# Altium schematic sheet PCB_DA2.schdoc
size 287 x 176 mm
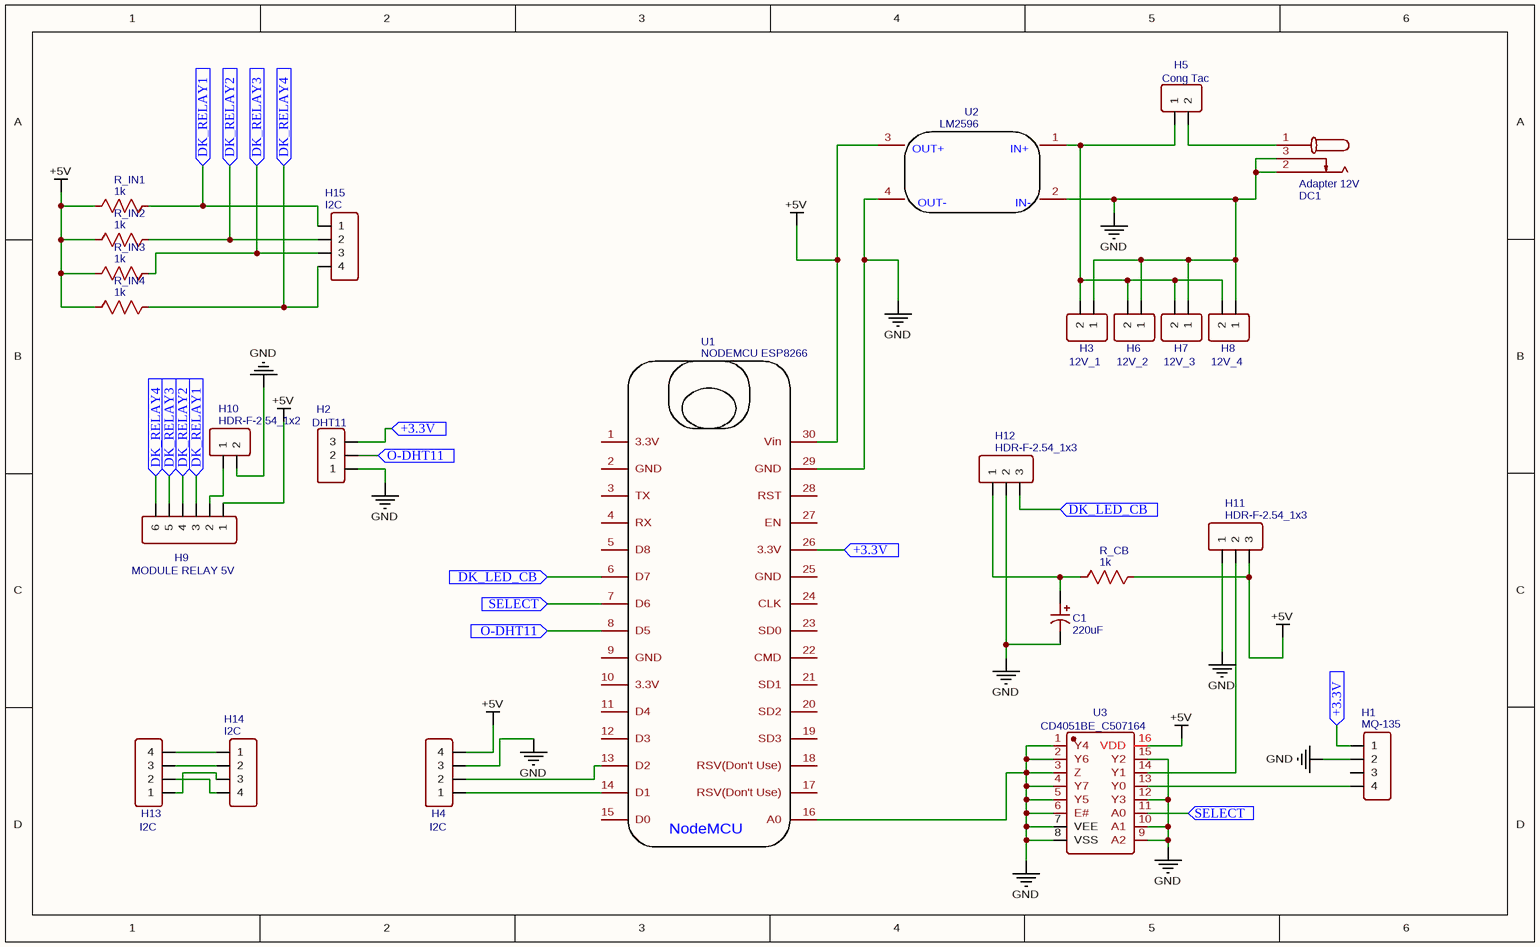
[diagram p0: PCB_DA2.schdoc]

## Parts
C1  220uF  [CAP-TH_BD10.0-P5.00-D0.6-FD]
DC1  Adapter 12V  [DC-IN-TH_DC005]
H1  MQ-135  [HDR-F-2.54_1X4]
H2  DHT11  [HDR-F-2.54_1X3]
H3  12V_1  [HDR-F-2.54_1X2]
H4  I2C  [HDR-F-2.54_1X4]
H5  Cong Tac  [HDR-F-2.54_1X2]
H6  12V_2  [HDR-F-2.54_1X2]
H7  12V_3  [HDR-F-2.54_1X2]
H8  12V_4  [HDR-F-2.54_1X2]
H9  MODULE RELAY 5V  [HDR-F-2.54_1X6]
H10  HDR-F-2.54_1x2  [HDR-F-2.54_1X2]
H11  HDR-F-2.54_1x3  [HDR-F-2.54_1X3]
H12  HDR-F-2.54_1x3  [HDR-F-2.54_1X3]
H13  I2C  [HDR-F-2.54_1X4]
H14  I2C  [HDR-F-2.54_1X4]
H15  I2C  [HDR-F-2.54_1X4]
R_CB  1k  [R_AXIAL-0.5]
R_IN1  1k  [R_AXIAL-0.5]
R_IN2  1k  [R_AXIAL-0.5]
R_IN3  1k  [R_AXIAL-0.5]
R_IN4  1k  [R_AXIAL-0.5]
U1  NODEMCU ESP8266  [ESP12E_DEVKIT-V1]
U2  LM2596  [LM2596DC_DC]
U3  CD4051BE_C507164  [DIP-16_L20.0-W6.4-P2.54-LS7.6-BL]

## Ports
+3.3V (in), DK_LED_CB (in), DK_RELAY1 (in), DK_RELAY2 (in), DK_RELAY3 (in), DK_RELAY4 (in), O-DHT11 (in), SELECT (in)

## Nets
+5V: H4.4 H9.1 H11.3 R_CB.2 R_IN1.1 R_IN2.1 R_IN3.1 R_IN4.1 U1.30(Vin) U2.3 U3.16(VDD)
GND: C1.2 DC1.2 DC1.3 H1.2 H2.1 H3.1 H4.3 H6.1 H7.1 H8.1 H10.2 H11.1 H12.2 U1.16(A0) U1.29(GND) U2.2 U2.4 U3.1(Y4) U3.2(Y6) U3.3(Z) U3.4(Y7) U3.5(Y5) U3.6(E#) U3.7(VEE) U3.8(VSS) U3.9(A2) U3.10(A1) U3.12(Y3) U3.15(Y2)
+3.3V: H1.1 H2.3 U1.26(3.3V) ; port +3.3V
DK_LED_CB: H12.3 U1.6(D7) ; port DK_LED_CB
DK_RELAY1: H9.3 H15.1 R_IN1.2 ; port DK_RELAY1
DK_RELAY2: H9.4 H15.2 R_IN2.2 ; port DK_RELAY2
DK_RELAY3: H9.5 H15.3 R_IN3.2 ; port DK_RELAY3
DK_RELAY4: H9.6 H15.4 R_IN4.2 ; port DK_RELAY4
O-DHT11: H2.2 U1.8(D5) ; port O-DHT11
SELECT: U1.7(D6) U3.11(A0) ; port SELECT
NetC1_1: C1.1 H12.1 R_CB.1
NetDC1_1: DC1.1 H5.2
NetH1_4: H1.4 U3.13(Y0)
NetH3_2: H3.2 H5.1 H6.2 H7.2 H8.2 U2.1
NetH4_1: H4.1 U1.14(D1)
NetH4_2: H4.2 U1.13(D2)
NetH9_2: H9.2 H10.1
NetH11_2: H11.2 U3.14(Y1)
NetH13_1: H13.1 H14.3
NetH13_2: H13.2 H14.4
NetH13_3: H13.3 H14.2
NetH13_4: H13.4 H14.1

Not connected (* = marked no-connect by the designer): H1 3; U1 1(3.3V) 2(GND) 3(TX) 4(RX) 5(D8) 9(GND) 10(3.3V) 11(D4) 12(D3) 15(D0) 17(RSV(Don't_Use)) 18(RSV(Don't_Use)) 19(SD3) 20(SD2) 21(SD1) 22(CMD) 23(SD0) 24(CLK) 25(GND) 27(EN) 28(RST)

## Notes on the sheet
- (in symbol LM2596) OUT+; IN+; OUT-; IN-
- (in symbol NODEMCU ESP8266) NodeMCU

## Library data of the parts
C1 = 220uF: Manufacturer: ELNA(伊娜); Manufacturer Part: RFO-35V221MH3P#; nameAlias: Value; Contributor: lcsc; Supplier: LCSC; Supplier Part: C399650; JLCPCB Part Class: Extended Part; spicePre: C; spiceSymbolName: RFO-35V221MH3P#
DC1 = Adapter 12V: Manufacturer: SOFNG; Manufacturer Part: DC005-2.0MM; Supplier: LCSC; Supplier Part: C111567; spicePre: D; spiceSymbolName: DC005-2.0MM
H1 = MQ-135: Contributor: LCEDA_Lib; Supplier Part: C225501; Supplier: LCSC; spicePre: H; spiceSymbolName: HDR-F-2.54_1x4
H2 = DHT11: Contributor: LCEDA_Lib; Supplier Part: C146690; Supplier: LCSC; spicePre: H; spiceSymbolName: HDR-F-2.54_1x3
H3 = 12V_1: Contributor: LCEDA_Lib; Supplier Part: C49661; Supplier: LCSC; spicePre: H; spiceSymbolName: HDR-F-2.54_1x2
H4 H13-H15 = I2C: Contributor: LCEDA_Lib; Supplier Part: C225501; Supplier: LCSC; spicePre: H; spiceSymbolName: HDR-F-2.54_1x4
H5 = Cong Tac: Contributor: LCEDA_Lib; Supplier Part: C49661; Supplier: LCSC; spicePre: H; spiceSymbolName: HDR-F-2.54_1x2
H6 = 12V_2: Contributor: LCEDA_Lib; Supplier Part: C49661; Supplier: LCSC; spicePre: H; spiceSymbolName: HDR-F-2.54_1x2
H7 = 12V_3: Contributor: LCEDA_Lib; Supplier Part: C49661; Supplier: LCSC; spicePre: H; spiceSymbolName: HDR-F-2.54_1x2
H8 = 12V_4: Contributor: LCEDA_Lib; Supplier Part: C49661; Supplier: LCSC; spicePre: H; spiceSymbolName: HDR-F-2.54_1x2
H9 = MODULE RELAY 5V: Contributor: LCEDA_Lib; Supplier Part: C40877; Supplier: LCSC; spicePre: H; spiceSymbolName: HDR-F-2.54_1x6
H10 = HDR-F-2.54_1x2: Contributor: LCEDA_Lib; Supplier Part: C49661; Supplier: LCSC; spicePre: H; spiceSymbolName: HDR-F-2.54_1x2
H11 H12 = HDR-F-2.54_1x3: Contributor: LCEDA_Lib; Supplier Part: C146690; Supplier: LCSC; spicePre: H; spiceSymbolName: HDR-F-2.54_1x3
R_CB R_IN1-R_IN4 = 1k: nameAlias: Value(Ω); Contributor: LCEDA_Lib; spicePre: R; spiceSymbolName: R_AXIAL-0.5_US
U1 = NODEMCU ESP8266: nameAlias: Model; Contributor: Milinda Bandara; sourceId: OGtr1ZXUS; sim: true; spicePre: X; timeStamp: 1458805415; spiceSymbolName: NODEMCU ESP8266
U2 = LM2596: nameAlias: Model; catid: 20; Contributor: utk.pekerjaan; sim: true; spicePre: X; spiceSymbolName: LM2596
U3 = CD4051BE_C507164: Manufacturer: HGSEMI(华冠); Contributor: LCSC; Supplier: LCSC; Supplier Part: C507164; Manufacturer Part: CD4051BE; JLCPCB Part Class: Extended Part; spicePre: U; spiceSymbolName: CD4051BE_C507164